# Altium schematic sheet power_output_SCH3.SchDoc
size B; Organization: CWRUbotix; Address1: 10900 Euclid Avenue; Address2: Cleveland, OH 44106; Address3: USA
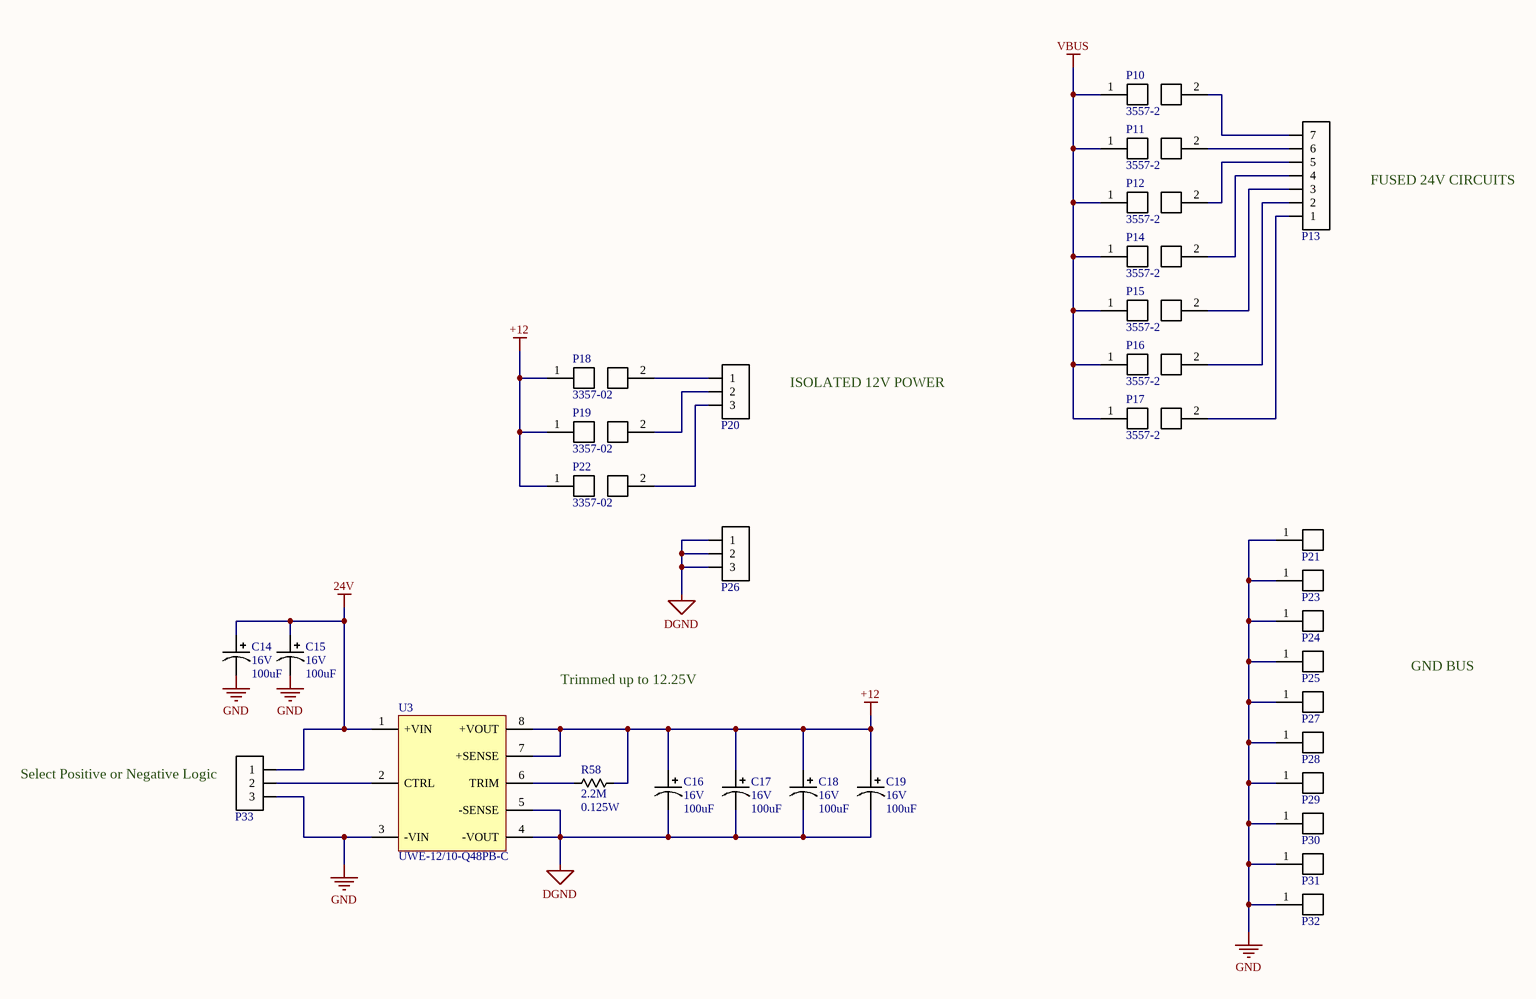
[diagram p0: power_output_SCH3.SchDoc]

## Parts
C14  Voltage Rating: 16V  Capacitance: 100uF  [chip_2917_AVX_TAJD]  (hidden comment: cap_single_p)
C15  Voltage Rating: 16V  Capacitance: 100uF  [chip_2917_AVX_TAJD]  (hidden comment: cap_single_p)
C16  Voltage Rating: 16V  Capacitance: 100uF  [chip_2917_AVX_TAJD]  (hidden comment: cap_single_p)
C17  Voltage Rating: 16V  Capacitance: 100uF  [chip_2917_AVX_TAJD]  (hidden comment: cap_single_p)
C18  Voltage Rating: 16V  Capacitance: 100uF  [chip_2917_AVX_TAJD]  (hidden comment: cap_single_p)
C19  Voltage Rating: 16V  Capacitance: 100uF  [chip_2917_AVX_TAJD]  (hidden comment: cap_single_p)
P10  Manufacturer PN: 3557-2  [FUSE_HOLDER_KEYSTONE_3557-2]  (hidden comment: conn-fuse-holder_0)
P11  Manufacturer PN: 3557-2  [FUSE_HOLDER_KEYSTONE_3557-2]  (hidden comment: conn-fuse-holder_0)
P12  Manufacturer PN: 3557-2  [FUSE_HOLDER_KEYSTONE_3557-2]  (hidden comment: conn-fuse-holder_0)
P13  conn-7x1_0  [MOLEX_387207507]  (value not drawn)
P14  Manufacturer PN: 3557-2  [FUSE_HOLDER_KEYSTONE_3557-2]  (hidden comment: conn-fuse-holder_0)
P15  Manufacturer PN: 3557-2  [FUSE_HOLDER_KEYSTONE_3557-2]  (hidden comment: conn-fuse-holder_0)
P16  Manufacturer PN: 3557-2  [FUSE_HOLDER_KEYSTONE_3557-2]  (hidden comment: conn-fuse-holder_0)
P17  Manufacturer PN: 3557-2  [FUSE_HOLDER_KEYSTONE_3557-2]  (hidden comment: conn-fuse-holder_0)
P18  Manufacturer PN: 3357-02  [FUSE_HOLDER_KEYSTONE_3557-2]  (hidden comment: conn-fuse-holder_0)
P19  Manufacturer PN: 3357-02  [FUSE_HOLDER_KEYSTONE_3557-2]  (hidden comment: conn-fuse-holder_0)
P20  conn-3x1_0  [PHOENIX_MKDS_5.08MM_3x1]  (value not drawn)
P21  conn-1x1_0  [KEYSTONE_7798]  (value not drawn)
P22  Manufacturer PN: 3357-02  [FUSE_HOLDER_KEYSTONE_3557-2]  (hidden comment: conn-fuse-holder_0)
P23  conn-1x1_0  [KEYSTONE_7798]  (value not drawn)
P24  conn-1x1_0  [KEYSTONE_7798]  (value not drawn)
P25  conn-1x1_0  [KEYSTONE_7798]  (value not drawn)
P26  conn-3x1_0  [PHOENIX_MKDS_5.08MM_3x1]  (value not drawn)
P27  conn-1x1_0  [KEYSTONE_7798]  (value not drawn)
P28  conn-1x1_0  [KEYSTONE_7798]  (value not drawn)
P29  conn-1x1_0  [KEYSTONE_7798]  (value not drawn)
P30  conn-1x1_0  [KEYSTONE_7798]  (value not drawn)
P31  conn-1x1_0  [KEYSTONE_7798]  (value not drawn)
P32  conn-1x1_0  [KEYSTONE_7798]  (value not drawn)
P33  conn-3x1_0  [hddr_3x1_0]  (value not drawn)
R58  Resistance: 2.2M  Power Rating: 0.125W  [chip_0805]  (hidden comment: res_single)
U3  Manufacturer PN: UWE-12/10-Q48PB-C  [EIGHTH_BRICK_6_0]  (hidden comment: eighth_brick_module_8)

## Nets
24V: C14.1 C15.1 P33.1 U3.1(+VIN)
+12: C16.1 C17.1 C18.1 C19.1 P18.1 P19.1 P22.1 R58.2 U3.7(+SENSE) U3.8(+VOUT)
DGND: C16.2 C17.2 C18.2 C19.2 P26.1 P26.2 P26.3 U3.4(-VOUT) U3.5(-SENSE)
GND: C14.2 C15.2 P21.1(P) P23.1(P) P24.1(P) P25.1(P) P27.1(P) P28.1(P) P29.1(P) P30.1(P) P31.1(P) P32.1(P) P33.3 U3.3(-VIN)
VBUS: P10.1 P11.1 P12.1 P14.1 P15.1 P16.1 P17.1
NetP10_2: P10.2 P13.7
NetP11_2: P11.2 P13.6
NetP12_2: P12.2 P13.5
NetP13_1: P13.1 P17.2
NetP13_2: P13.2 P16.2
NetP13_3: P13.3 P15.2
NetP13_4: P13.4 P14.2
NetP18_2: P18.2 P20.1
NetP19_2: P19.2 P20.2
NetP20_3: P20.3 P22.2
NetP33_2: P33.2 U3.2(CTRL)
NetR58_1: R58.1 U3.6(TRIM)

## Notes on the sheet
- FUSED 24V CIRCUITS
- ISOLATED 12V POWER
- Trimmed up to 12.25V
- GND BUS
- (near P33) Select Positive or Negative Logic
- Title
- Size:
- B
- Number:
- Revision:
- Date:
- Sheet
- of

## Library data of the parts
C14-C19 = CAP-00550: CAP, 100uF, ±10%, 16V, Tantalum, 2917; Manufacturer: AVX; Manufacturer PN: TAJD107K016RNJ; Tolerance: ±10%; Part Number: CAP-00550; Type: Tantalum; Cost: $0.94
P10-P12 P14-P19 P22 = CONN-00015: Fuse Holder, 30A, 500V, LP-Mini 897, ATOF 257; Manufacturer: Keystone Electronics; Current: 30; Positions per level: 2; Levels: 1; Part Number: CONN-00015
  P10-P12 P14-P17: Cost: 1.03
  P18 P19 P22: Cost: 0.98
P13 = CONN-00051: Barrier Blk, 7 Pos, 25A, 300V, 0.375" pitch; Manufacturer: Molex; Manufacturer PN: 387207507; Positions per level: 7; Levels: 1; Part Number: CONN-00051; Type: Barrier Block; Cost: 4.79
P20 P26 = CONN-00021: Term Blk, 3 Pos, 0.2", 10A, 14-30 AWG, Rising Cage Clamp; Manufacturer: Phoenix Contact; Manufacturer PN: 1729131; Positions per level: 3; Levels: 1; Current: 10; Part Number: CONN-00021; Type: Terminal Block; Cost: 0.79
P21 P23-P25 P27-P32 = CONN-00042: Screw Terminal, M4, 30A; Manufacturer PN: 7798; Manufacturer: Keystone; Positions per level: 1; Part Number: CONN-00042; Type: Screw Terminal; Levels: 1; Cost: 0.5; Weight: 3.27
P33 = CONN-00037: Header, 3x1, 0.1"; Positions per level: 3; Levels: 1; Part Number: CONN-00037; Type: Header
R58 = RES-00367: RES SMD 2.2M OHM 1% 1/8W 0805; Manufacturer: Rohm Semiconductor; Manufacturer PN: KTR10EZPF2204; Tolerance: 1%; Part Number: RES-00367
U3 = PWREG-00026: Module, Isolated, Eighth-Brick, 12V, 10A, Positive Logic; Manufacturer: Murata; Voltage Range In: 18 - 75V; Reg Type: Isolated Module; Fixed/Adj: Fixed; Part Number: PWREG-00026; Voltage Range Out: 12V; Max Current: 10A; Cost: 47; Weight: 20